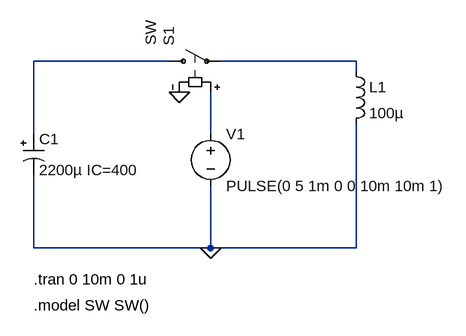
[diagram p0: schematic Coilgun-1V00.asc]
Coilgun-1V00.asc, the LTspice schematic file:
Version 4
SHEET 1 880 680
WIRE -16 -160 -224 -160
WIRE 272 -160 64 -160
WIRE 272 -144 272 -160
WIRE -224 -48 -224 -160
WIRE 48 -48 48 -112
WIRE -224 128 -224 16
WIRE 48 128 48 32
WIRE 48 128 -224 128
WIRE 272 128 272 -64
WIRE 272 128 48 128
FLAG 48 128 0
FLAG 0 -112 0
SYMBOL polcap -240 -48 R0
WINDOW 3 24 56 Left 2
SYMATTR Value 2200µ IC=400
SYMATTR InstName C1
SYMATTR SpiceLine V=63 Irms=900m Rser=0.1 Lser=0
SYMATTR Description Capacitor
SYMATTR Type cap
SYMBOL ind 256 -160 R0
SYMATTR InstName L1
SYMATTR Value 100µ
SYMATTR SpiceLine Rser=133m
SYMBOL sw -32 -160 R270
WINDOW 3 24 -12 Left 2
WINDOW 38 24 -12 Left 2
SYMATTR Value ""
SYMATTR SpiceModel SW
SYMATTR InstName S1
SYMBOL voltage 48 -64 R0
WINDOW 123 0 0 Left 2
WINDOW 39 0 0 Left 2
SYMATTR InstName V1
SYMATTR Value PULSE(0 5 1m 0 0 10m 10m 1)
TEXT -224 176 Left 2 !.tran 0 10m 0 1u
TEXT -224 216 Left 2 !.model SW SW()

The netlist it stands for:
* Coilgun-1V00.asc
C1 N001 0 2200µ IC=400 V=63 Irms=900m Rser=0.1 Lser=0
L1 N002 0 100µ Rser=133m
S1 N001 N002 N003 0 SW
V1 N003 0 PULSE(0 5 1m 0 0 10m 10m 1)
.tran 0 10m 0 1u
.model SW SW()
.backanno
.end